# Altium schematic sheet stm32.SchDoc
size A4
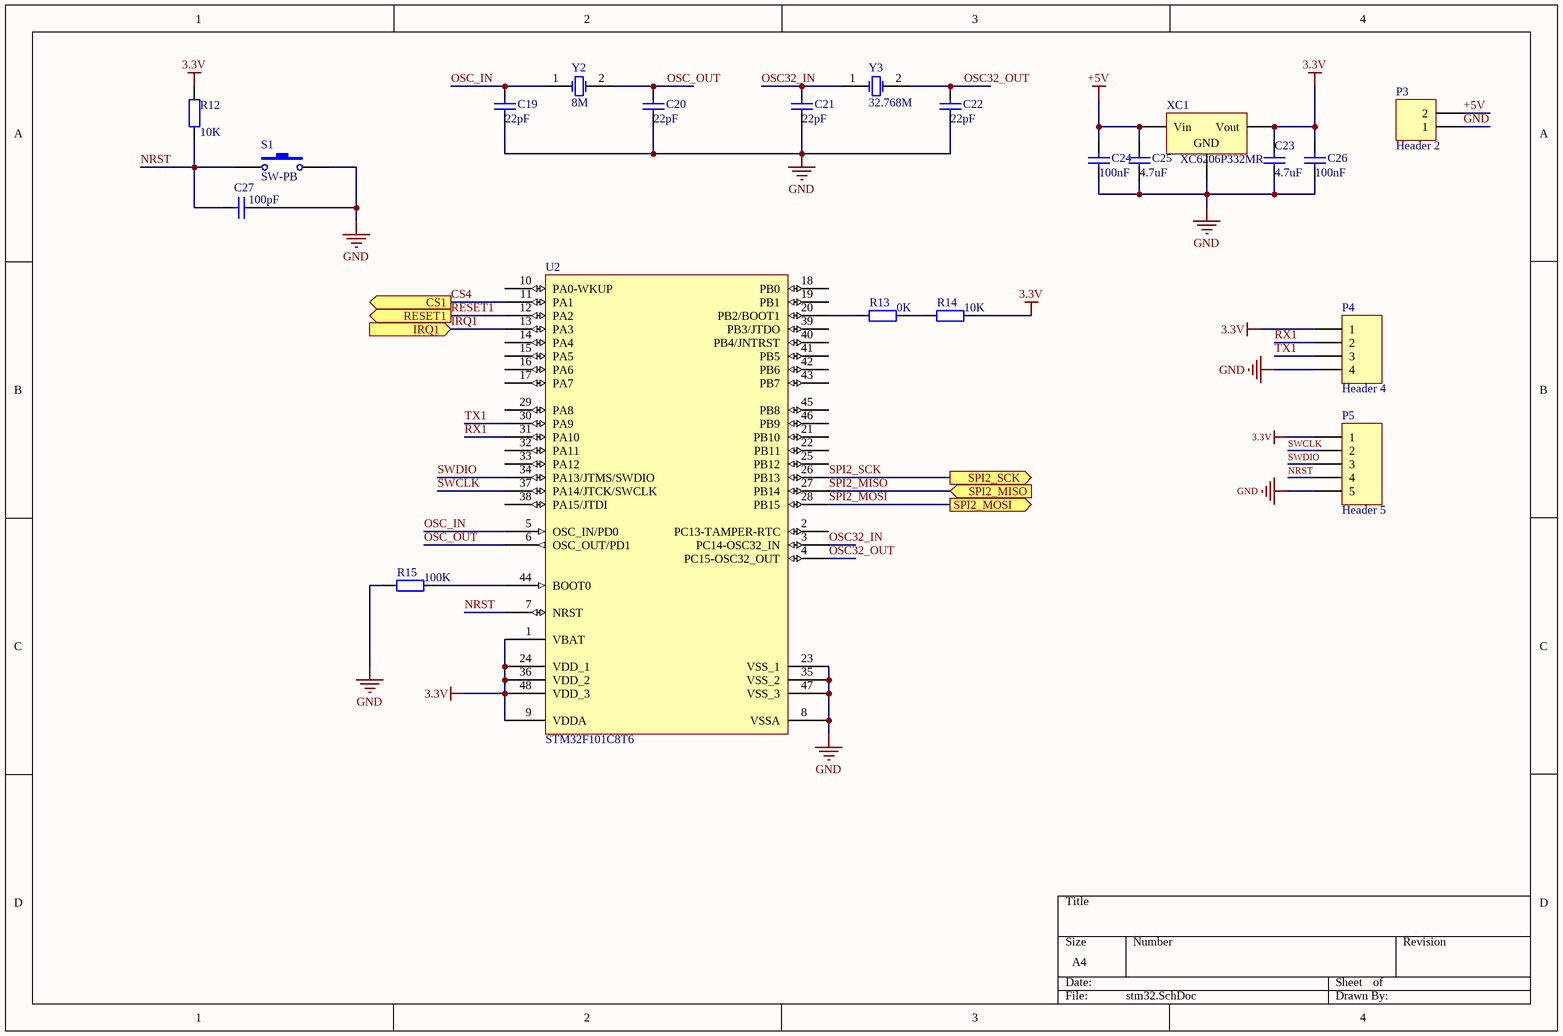
[diagram p0: stm32.SchDoc]

## Parts
C19  value 22pF  [1608[0603]]  (hidden comment: Cap Semi)
C20  value 22pF  [1608[0603]]  (hidden comment: Cap Semi)
C21  value 22pF  [1608[0603]]  (hidden comment: Cap Semi)
C22  value 22pF  [1608[0603]]  (hidden comment: Cap Semi)
C23  value 4.7uF  [1608[0603]]  (hidden comment: Cap Semi)
C24  value 100nF  [1608[0603]]  (hidden comment: Cap Semi)
C25  value 4.7uF  [1608[0603]]  (hidden comment: Cap Semi)
C26  value 100nF  [1608[0603]]  (hidden comment: Cap Semi)
C27  value 100pF  [1608[0603]]  (hidden comment: Cap Semi)
P3  Header 2  [HDR1X2]
P4  Header 4  [HDR1X4]
P5  Header 5  [HDR1X5]
R12  value 10K  [1608[0603]]  (hidden comment: Res2)
R13  value 0K  [1608[0603]]  (hidden comment: Res2)
R14  value 10K  [1608[0603]]  (hidden comment: Res2)
R15  value 100K  [AXIAL-0.4]  (hidden comment: Res2)
S1  SW-PB  [SPST-2]
U2  STM32F101C8T6  [LQFP48_N]
XC1  XC6206P332MR  [SOT89L]
Y2  8M  [HC-48SMD]
Y3  32.768M  [FC135]

## Ports
CS1 (out), IRQ1 (in), RESET1 (out), SPI2_MISO (in), SPI2_MOSI (out), SPI2_SCK (out)

## Nets
3.3V: C23.2 C26.2 P4.1 P5.1 R12.1 R14.2 U2.1(VBAT) U2.9(VDDA) U2.24(VDD_1) U2.36(VDD_2) U2.48(VDD_3) XC1.3(Vout)
+5V: C24.2 C25.2 P3.2 XC1.1(Vin)
GND: C19.1 C20.1 C21.1 C22.1 C23.1 C24.1 C25.1 C26.1 C27.2 P3.1 P4.4 P5.5 R15.1 S1.2 U2.8(VSSA) U2.23(VSS_1) U2.35(VSS_2) U2.47(VSS_3) XC1.2(GND)
CS4: U2.11(PA1) ; port CS1
IRQ1: U2.13(PA3) ; port IRQ1
NRST: C27.1 P5.4 R12.2 S1.1 U2.7(NRST)
OSC32_IN: C21.2 U2.3(PC14-OSC32_IN) Y3.1(OSC1)
OSC32_OUT: C22.2 U2.4(PC15-OSC32_OUT) Y3.2(OSC2)
OSC_IN: C19.2 U2.5(OSC_IN/PD0) Y2.1(OSC1)
OSC_OUT: C20.2 U2.6(OSC_OUT/PD1) Y2.2(OSC2)
RESET1: U2.12(PA2) ; port RESET1
RX1: P4.2 U2.31(PA10)
SPI2_MISO: U2.27(PB14) ; port SPI2_MISO
SPI2_MOSI: U2.28(PB15) ; port SPI2_MOSI
SPI2_SCK: U2.26(PB13) ; port SPI2_SCK
SWCLK: P5.2 U2.37(PA14/JTCK/SWCLK)
SWDIO: P5.3 U2.34(PA13/JTMS/SWDIO)
TX1: P4.3 U2.30(PA9)
NetR13_1: R13.1 U2.20(PB2/BOOT1)
NetR13_2: R13.2 R14.1
NetR15_2: R15.2 U2.44(BOOT0)

Not connected (* = marked no-connect by the designer): U2 2(PC13-TAMPER-RTC) 10(PA0-WKUP) 14(PA4) 15(PA5) 16(PA6) 17(PA7) 18(PB0) 19(PB1) 21(PB10) 22(PB11) 25(PB12) 29(PA8) 32(PA11) 33(PA12) 38(PA15/JTDI) 39(PB3/JTDO) 40(PB4/JNTRST) 41(PB5) 42(PB6) 43(PB7) 45(PB8) 46(PB9)

## Library data of the parts
C19-C27 = Cap Semi: Capacitor (Semiconductor SIM Model); Published: 8-Jun-2000; LatestRevisionDate: 29-May-2009; LatestRevisionNote: IPC-7351 Footprint Added.; PackageReference: C1206; Publisher: Altium Limited; PackageDescription: Chip Capacitor
P3 = Header 2: Header, 2-Pin; LatestRevisionDate: 17-Jul-2002; LatestRevisionNote: Re-released for DXP Platform.; Publisher: Altium Limited
P4 = Header 4: Header, 4-Pin; LatestRevisionDate: 17-Jul-2002; LatestRevisionNote: Re-released for DXP Platform.; Publisher: Altium Limited
P5 = Header 5: Header, 5-Pin; LatestRevisionDate: 17-Jul-2002; LatestRevisionNote: Re-released for DXP Platform.; Publisher: Altium Limited
R12-R15 = Res2: Resistor; Published: 8-Jun-2000; LatestRevisionDate: 17-Jul-2002; LatestRevisionNote: Re-released for DXP Platform.; PackageReference: AXIAL-0.4; Publisher: Altium Limited; PackageDescription: Axial Device, Thru-Hole; 2 Leads; 0.4 in Pin Spacing
S1 = SW-PB: Switch; Published: 24-Mar-1999; LatestRevisionDate: 17-Jul-2002; LatestRevisionNote: Re-released for DXP Platform.; PackageReference: SPST-2; Publisher: Altium Limited; PackageDescription: Switch; 2 Leads
U2 = STM32F101C8T6: STM32 ARM-based 32-bit MCU with 64 Kbytes Flash, 48-pin LQFP, Industrial Temperature; Published: 30-May-2008; DatasheetVersion: rev6, Mar-2008; PackageVersion: Mar-2008; PackageReference: LQFP48; Publisher: Altium Limited; PackageDescription: 48-Pin Low-Profile Quad Flat Pack, 7 x 7 mm Body, 0.5 mm Pitch (LQFP48); ComponentLink1Description: Manufacturer Link; ComponentLink1URL: www.st.com/stm32; ComponentLink2Description: Datasheet; ComponentLink2URL: http://www.st.com/stonline/products/literature/ds/13586.pdf
XC1 = Volt Reg: Voltage Regulator; Published: 24-Mar-1999; LatestRevisionDate: 29-May-2009; LatestRevisionNote: IPC-7351 Footprint Added.; PackageReference: D2PAK; Publisher: Altium Limited; PackageDescription: 3-Pin Transistor Outline Package 2.54 mm Pitch, 15.1 mm Lead Span
Y2 Y3 = XTAL: Crystal Oscillator; Published: 8-Jun-2000; LatestRevisionDate: 17-Jul-2002; LatestRevisionNote: Re-released for DXP Platform.; PackageReference: R38; Publisher: Altium Limited; PackageDescription: Crystal, Thru-Hole; 2 Leads; Body 3.1 x 8.2 mm (Dia.xH)